# EAGLE design 2xVCA_SMD (EAGLE 7.1.0)
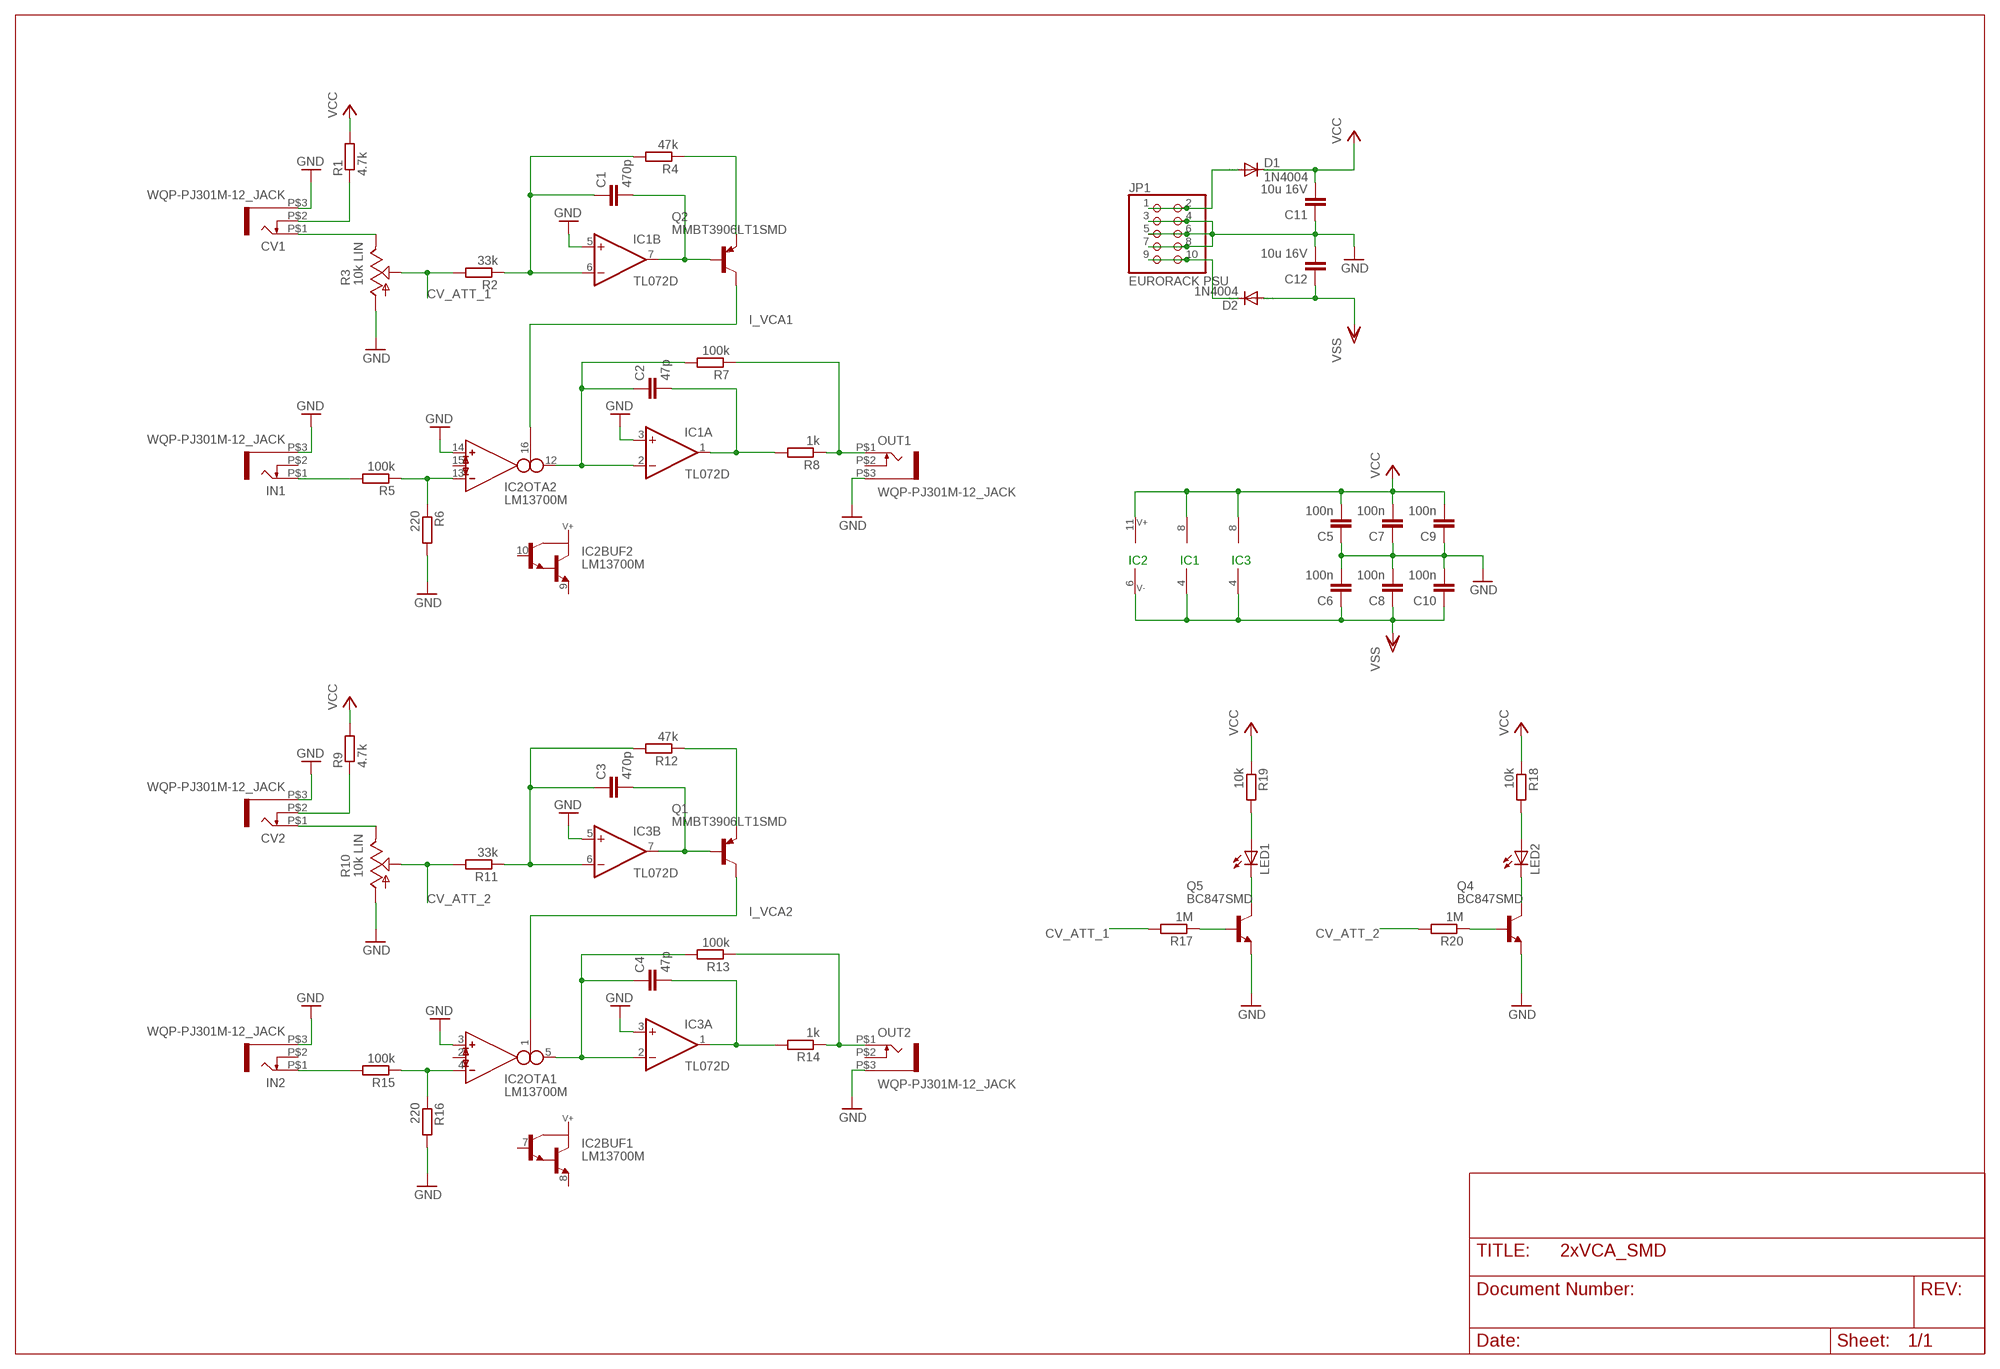
[diagram p0: schematic, sheet 1]

## Parts
C1  470p  C-EUC0603K  [C0603K]
C2  47p  C-EUC0603K  [C0603K]
C3  470p  C-EUC0603K  [C0603K]
C4  47p  C-EUC0603K  [C0603K]
C5  100n  C-EUC0603K  [C0603K]
C6  100n  C-EUC0603K  [C0603K]
C7  100n  C-EUC0603K  [C0603K]
C8  100n  C-EUC0603K  [C0603K]
C9  100n  C-EUC0603K  [C0603K]
C10  100n  C-EUC0603K  [C0603K]
C11  10u 16V  C-EUC1206K  [C1206K]
C12  10u 16V  C-EUC1206K  [C1206K]
CV1  WQP-PJ301M-12_JACK  [WQP-PJ301M-12_JACK]
CV2  WQP-PJ301M-12_JACK  [WQP-PJ301M-12_JACK]
D1  1N4004  DIODE-DO214AA  [DO214AA]
D2  1N4004  DIODE-DO214AA  [DO214AA]
IC1  TL072D  [SO08]
IC2  LM13700M  [SO16]
IC3  TL072D  [SO08]
IN1  WQP-PJ301M-12_JACK  [WQP-PJ301M-12_JACK]
IN2  WQP-PJ301M-12_JACK  [WQP-PJ301M-12_JACK]
JP1  EURORACK PSU  PINHD-2X5  [2X05]
LED1  LED3MM  [LED3MM]
LED2  LED3MM  [LED3MM]
OUT1  WQP-PJ301M-12_JACK  [WQP-PJ301M-12_JACK]
OUT2  WQP-PJ301M-12_JACK  [WQP-PJ301M-12_JACK]
Q1  MMBT3906LT1SMD  [SOT23-BEC]
Q2  MMBT3906LT1SMD  [SOT23-BEC]
Q4  BC847SMD  [SOT23]
Q5  BC847SMD  [SOT23]
R1  4.7k  R-EU_R0603  [R0603]
R2  33k  R-EU_R0603  [R0603]
R3  10k LIN  POT_USVERTICAL  [ALPS_POT_VERTICAL]
R4  47k  R-EU_R0603  [R0603]
R5  100k  R-EU_R0603  [R0603]
R6  220  R-EU_R0603  [R0603]
R7  100k  R-EU_R0603  [R0603]
R8  1k  R-EU_R0603  [R0603]
R9  4.7k  R-EU_R0603  [R0603]
R10  10k LIN  POT_USVERTICAL  [ALPS_POT_VERTICAL]
R11  33k  R-EU_R0603  [R0603]
R12  47k  R-EU_R0603  [R0603]
R13  100k  R-EU_R0603  [R0603]
R14  1k  R-EU_R0603  [R0603]
R15  100k  R-EU_R0603  [R0603]
R16  220  R-EU_R0603  [R0603]
R17  1M  R-EU_R0603  [R0603]
R18  10k  R-EU_R0603  [R0603]
R19  10k  R-EU_R0603  [R0603]
R20  1M  R-EU_R0603  [R0603]

## Nets
CV_ATT_1: R2.2 R3.P$2(S) R17.2
CV_ATT_2: R10.P$2(S) R11.2 R20.2
GND: C5.1 C6.2 C7.1 C8.2 C9.1 C10.2 C11.1 C12.2 CV1.P$3 CV2.P$3 IC1.3(A:+IN) IC1.5(B:+IN) IC2.3(OTA1:IN_P) IC2.14(OTA2:IN_P) IC3.3(A:+IN) IC3.5(B:+IN) IN1.P$3 IN2.P$3 JP1.3 JP1.4 JP1.5 JP1.6 JP1.7 JP1.8 OUT1.P$3 OUT2.P$3 Q4.2(E) Q5.2(E) R3.P$3(A) R6.2 R10.P$3(A) R16.2
I_VCA1: IC2.16(OTA2:I_BIAS) Q2.C
I_VCA2: IC2.1(OTA1:I_BIAS) Q1.C
N$1: IN2.P$1 R15.2
N$2: CV1.P$2 R1.1
N$3: CV1.P$1 R3.P$1(E)
N$4: Q5.1(B) R17.1
N$5: C1.1 IC1.6(B:-IN) R2.1 R4.2
N$6: C2.1 IC1.2(A:-IN) IC2.12(OTA2:OUT) R7.2
N$7: C1.2 IC1.7(B:OUT) Q2.B
N$8: Q2.E R4.1
N$9: IC2.13(OTA2:IN_N) R5.1 R6.1
N$10: IC2.4(OTA1:IN_N) R15.1 R16.1
N$11: IN1.P$1 R5.2
N$12: C2.2 IC1.1(A:OUT) R8.2
N$13: OUT1.P$1 R7.1 R8.1
N$15: C4.1 IC2.5(OTA1:OUT) IC3.2(A:-IN) R13.2
N$16: CV2.P$2 R9.1
N$17: CV2.P$1 R10.P$1(E)
N$18: LED1.A R19.2
N$19: C3.1 IC3.6(B:-IN) R11.1 R12.2
N$20: OUT2.P$1 R13.1 R14.1
N$21: C3.2 IC3.7(B:OUT) Q1.B
N$22: Q1.E R12.1
N$23: C4.2 IC3.1(A:OUT) R14.2
N$24: LED1.K(C) Q5.3(C)
N$25: LED2.A R18.2
N$26: LED2.K(C) Q4.3(C)
N$27: Q4.1(B) R20.1
N$28: D1.A JP1.1 JP1.2
N$30: D2.C JP1.9 JP1.10
VCC: C5.2 C7.2 C9.2 C11.2 D1.C IC1.8(P:V+) IC2.11(SUPPLY:V+) IC3.8(P:V+) R1.2 R9.2 R18.1 R19.1
VSS: C6.1 C8.1 C10.1 C12.1 D2.A IC1.4(P:V-) IC2.6(SUPPLY:V-) IC3.4(P:V-)
Unconnected: IC2.2(OTA1:I_DIODE) IC2.7(BUF1:B) IC2.8(BUF1:E) IC2.9(BUF2:E) IC2.10(BUF2:B) IC2.15(OTA2:I_DIODE) IN1.P$2 IN2.P$2 OUT1.P$2 OUT2.P$2

## Notes on the sheet
- IC2 | IC1 | IC3

## Library data of the parts
C1-C12 = rcl:C-EU: CAPACITOR, European symbol
CV1 CV2 IN1 IN2 OUT1 OUT2 = thonkiconn:WQP-PJ301M-12_JACK
D1 D2 = diode:DIODE-: DIODE
IC1 IC3 = linear:TL072: OP AMP
IC2 = ota:LM13700: Dual OTA with buffers
JP1 = pinhead:PINHD-2X5: PIN HEADER
LED1 LED2 = led:LED: LED OSRAM: - CHIPLED LG R971, LG N971, LY N971, LG Q971, LY Q971, LO R971, LY R971 LH N974, LH R974 LS Q976, LO Q976, LY Q976 LO Q996 - Hyper CHIPLED LW Q18S LB Q993, LB Q99A, LB R99A - SideLED LS A670, LO A670, LY A670, LG A670, LP A670 LB A673, LV A673, LT A673, LW A673 LH A674 LY A675 LS A676, LA A676, LO A676, LY A676, LW A676 LS A679, LY A679, LG A679 - Hyper Micro SIDELED® LS Y876, LA Y876, LO Y876, LY Y876 LT Y87S - SmartLED LW L88C, LW L88S LB L89C, LB L89S, LG L890 LS L89K, LO L89K, LY L89K LS L896, LA L896, LO L896, LY L896 - TOPLED LS T670, LO T670, LY T670, LG T670, LP T670 LSG T670, LSP T670, LSY T670, LOP T670, LYG T670 LG T671, LOG T671, LSG T671 LB T673, LV T673, LT T673, LW T673 LH T674 LS T676, LA T676, LO T676, LY T676, LB T676, LH T676, LSB T676, LW T676 LB T67C, LV T67C, LT T67C, LS T67K, LO T67K, LY T67K, LW E67C LS E67B, LA E67B, LO E67B, LY E67B, LB E67C, LV E67C, LT E67C LW T67C LS T679, LY T679, LG T679 LS T770, LO T770, LY T770, LG T770, LP T770 LB T773, LV T773, LT T773, LW T773 LH T774 LS E675, LA E675, LY E675, LS T675 LS T776, LA T776, LO T776, LY T776, LB T776 LHGB T686 LT T68C, LB T68C - Hyper Mini TOPLED® LB M676 - Mini TOPLED Santana® LG M470 LS M47K, LO M47K, LY M47K Source: http://www.osram.convergy.de LUXEON: - LUMILED® LXK2-PW12-R00, LXK2-PW12-S00, LXK2-PW14-U00, LXK2-PW14-V00 LXK2-PM12-R00, LXK2-PM12-S00, LXK2-PM14-U00 LXK2-PE12-Q00, LXK2-PE12-R00, LXK2-PE12-S00, LXK2-PE14-T00, LXK2-PE14-U00 LXK2-PB12-K00, LXK2-PB12-L00, LXK2-PB12-M00, LXK2-PB14-N00, LXK2-PB14-P00, LXK2-PB14-Q00 LXK2-PR12-L00, LXK2-PR12-M00, LXK2-PR14-Q00, LXK2-PR14-R00 LXK2-PD12-Q00, LXK2-PD12-R00, LXK2-PD12-S00 LXK2-PH12-R00, LXK2-PH12-S00 LXK2-PL12-P00, LXK2-PL12-Q00, LXK2-PL12-R00 Source: www.luxeon.com KINGBRIGHT: KA-3528ASYC Source: www.kingbright.com
Q1 Q2 = transistor-pnp:MMBT3906*: PNP Transistror
Q4 Q5 = transistor-npn:BC847*: NPN Transistor
R1 R2 R4-R9 R11-R20 = rcl:R-EU_: RESISTOR, European symbol
R3 R10 = pot-alps:POT_US

## Board
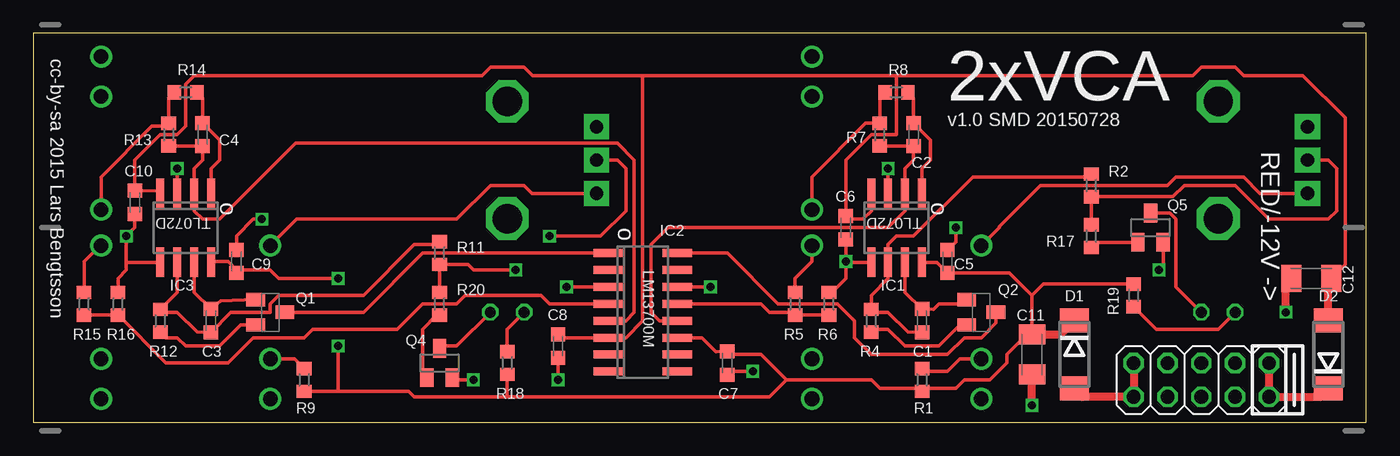
[diagram p1: board, top side]
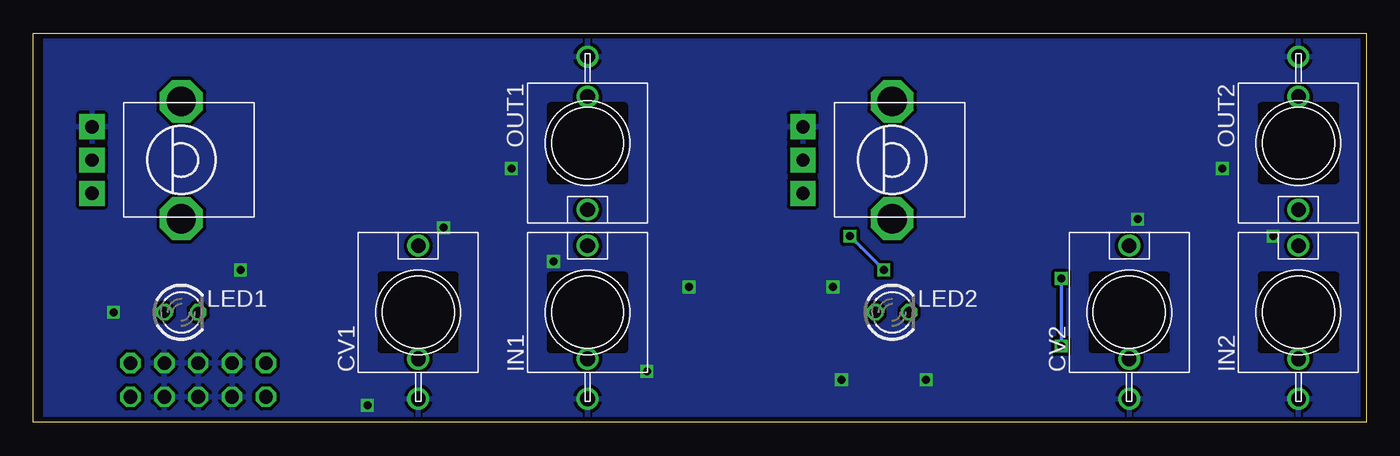
[diagram p2: board, bottom side, seen from below]

Size 100 x 29.2 mm. Coordinates in mm from the lower left corner, seen from the top.
Outline: 0,0 100,0 100,29.2 0,29.2 0,0
Copper layers (1*16): Top 0.0356mm / dielectric 1.5011mm / Bottom 0.0356mm
Design rules "LaenPCBOrder": minimum track width 6mil, minimum drill 13mil, track to track 6mil, track to pad 6mil, pad to pad 6mil, via to via 6mil, smd to smd 6mil, copper to edge 15mil, drill to drill 6mil, minimum pad ring 7mil, minimum via ring 7mil, stop-mask expansion 3mil, vias tented up to drill 0mil, thermal gap 10mil

### Footprints (pad centres in the part's own frame; a part is rotated, then mirrored left to right if it is on the bottom)
C0603K = smd 1.05 x 1.08: 1 -0.875,0; 2 0.875,0
C1206K = smd 1.5 x 2: 1 -1.5,0; 2 1.5,0
WQP-PJ301M-12_JACK = drill 1.1: P$1 0,5; P$2 0,-3.5; P$3 0,-6.5
DO214AA = smd 1.8 x 2.2: A 2.55,0; C -2.55,0
SO08 = smd 0.6 x 2.2: 1 -1.905,-2.6; 2 -0.635,-2.6; 3 0.635,-2.6; 4 1.905,-2.6; 5 1.905,2.6; 6 0.635,2.6; 7 -0.635,2.6; 8 -1.905,2.6
SO16 = smd 0.6 x 2.2: 1 -4.445,-2.6; 2 -3.175,-2.6; 3 -1.905,-2.6; 4 -0.635,-2.6; 5 0.635,-2.6; 6 1.905,-2.6; 7 3.175,-2.6; 8 4.445,-2.6; 9 4.445,2.6; 10 3.175,2.6; 11 1.905,2.6; 12 0.635,2.6; 13 -0.635,2.6; 14 -1.905,2.6; 15 -3.175,2.6; 16 -4.445,2.6
2X05 = drill 1.016 octagon: 1 -5.08,-1.27; 2 -5.08,1.27; 3 -2.54,-1.27; 4 -2.54,1.27; 5 0,-1.27; 6 0,1.27; 7 2.54,-1.27; 8 2.54,1.27; 9 5.08,-1.27; 10 5.08,1.27
LED3MM = drill 0.813 octagon: A -1.27,0; K 1.27,0
SOT23-BEC = smd 1 x 1.4: B -0.95,-1.1; C 0,1.1; E 0.95,-1.1
SOT23 = smd 1 x 1.4: 1 -0.95,-1.1; 2 0.95,-1.1; 3 0,1.1
R0603 = smd 1 x 1.1: 1 -0.85,0; 2 0.85,0
ALPS_POT_VERTICAL = drill 1 pad 1.88 square: P$1 -2.5,6.7; P$2 0,6.7; P$3 2.5,6.7 | drill 2.2 pad 3.175 octagon: P$4 -4.4,0; P$5 4.4,0

### Placement (x,y rotation side)
C1  66.67,7.62 90 top
C2  66.04,21.59 90 top
C3  13.34,7.62 90 top
C4  12.7,21.59 90 top
C5  68.58,12.07 270 top
C6  60.96,14.61 270 top
C7  52.07,4.45 90 top
C8  39.37,5.71 270 top
C9  15.24,12.07 270 top
C10  7.62,16.51 270 top
C11  74.93,5.08 90 top
C12  95.89,10.8 180 top
CV1  71.12,8.26 0 bottom
CV2  17.78,8.26 0 bottom
D1  78.11,5.08 270 top
D2  97.16,5.08 90 top
IC1  64.77,14.61 180 top
IC2  45.72,8.26 270 top
IC3  11.43,14.61 180 top
IN1  58.42,8.26 0 bottom
IN2  5.08,8.26 0 bottom
JP1  87.63,3.18 0 top
LED1  88.9,8.26 0 bottom
LED2  35.56,8.26 0 bottom
OUT1  58.42,20.96 180 bottom
OUT2  5.08,20.96 180 bottom
Q1  17.78,8.26 270 top
Q2  71.12,8.26 270 top
Q4  30.48,4.45 0 top
Q5  83.82,14.61 0 top
R1  66.67,3.18 270 top
R2  79.38,17.78 270 top
R3  88.9,19.68 90 bottom
R4  62.87,7.62 90 top
R5  57.15,8.89 90 top
R6  59.69,8.89 90 top
R7  63.5,21.59 270 top
R8  64.77,24.77 0 top
R9  20.32,3.18 270 top
R10  35.56,19.68 90 bottom
R11  30.48,12.7 270 top
R12  9.53,7.62 90 top
R13  10.16,21.59 270 top
R14  11.43,24.77 0 top
R15  3.81,8.89 90 top
R16  6.35,8.89 90 top
R17  79.38,13.97 90 top
R18  35.56,4.45 90 top
R19  82.55,9.53 270 top
R20  30.48,8.89 90 top

### Tracks (layer width: path | path; a pad name or v marks a point on that pad's centre or on a via)
CV_ATT_1
  Top 0.254: R17.2 R2.2 85.51,16.93 86.36,17.78 90.17,17.78 92.71,15.24 97.16,15.24 97.79,15.88 97.79,19.05 97.16,19.68 R3.P$2
CV_ATT_2  (via drill 0.6)
  Top 0.254: R20.2 R11.2 32.6,11.85 33.02,11.43 v36.2,11.43 | v38.73,13.97 42.55,13.97 44.45,15.88 44.45,19.05 43.81,19.68 R10.P$2
  Bottom 0.254: v36.2,11.43 v38.73,13.97
GND  (via drill 0.6)
  Top 0.254: C10.2 7.62,14.61 v6.99,13.97 6.99,12.07 7.04,12 | IC3.5 7.04,12 | R16.2 6.35,10.8 6.99,11.43 6.99,11.95 7.04,12 | C9.1 15.24,13.97 16.51,15.24 v17.14,15.24 | v50.8,10.16 IC2.14 | C6.2 v60.96,12.07 | IC1.5 61.02,12 v60.96,12.07 | R6.2 59.91,9.74 60.96,10.8 v60.96,12.07 | v69.22,14.61 69.22,13.55 C5.1 | v39.37,3.18 C8.2 | IC2.3 v40.01,10.16 | v53.98,3.81 52.28,3.81 C7.1 | IC1.3 v64.14,19.05 | v10.79,19.05 IC3.3 | Q5.2 84.77,11.75 v84.45,11.43 | v33.02,3.18 31.6,3.18 Q4.2
  Top 0.61: v74.93,1.27 C11.1 | v93.98,8.26 93.98,10.39 C12.2
  pour Bottom (isolate 0.254): 0.64,29.21 99.06,29.21 99.06,0 0.64,0
I_VCA1
  Top 0.254: Q2.C 72.22,7.45 71.12,6.35 69.85,6.35 68.58,5.08 62.87,5.08 61.59,6.35 61.59,7.62 60.33,8.89 55.88,8.89 52.07,12.7 IC2.16
I_VCA2
  Top 0.254: IC2.1 29.21,12.7 24.77,8.26 Q1.C
N$1
  Top 0.254: IN2.P$1 5,13.25 3.81,12.07 R15.2
N$2
  Top 0.254: CV1.P$2 69.53,4.76 68.58,3.81 66.89,3.81 R1.1
N$3
  Top 0.254: R3.P$1 92.03,17.18 90.81,18.41 85.72,18.41 85.09,17.78 75.56,17.78 72.47,14.68 72.47,14.61 CV1.P$1
N$4
  Top 0.254: Q5.1 79.76,13.5 R17.1
N$5
  Top 0.254: C1.1 65.62,6.77 64.14,8.26 63.08,8.26 R4.2 62.87,9.53 64.14,10.8 IC1.6 64.14,13.34 64.77,13.97 66.04,13.97 70.48,18.41 79.16,18.41 R2.1
N$6
  Top 0.254: R7.2 63.52,20.71 C2.1 66.04,19.68 65.41,19.05 IC1.2 65.41,15.88 64.14,14.61 47.62,14.61 46.35,13.34 46.35,8.26 46.99,7.62 IC2.12
N$7
  Top 0.254: IC1.7 65.41,9.74 C1.2 67.53,8.47 67.94,8.89 69.7,8.89 Q2.B
N$8
  Top 0.254: Q2.E 69.53,7.3 67.94,5.71 65.41,5.71 64.14,6.98 63.08,6.98 R4.1
N$9
  Top 0.254: IC2.13 54.61,8.89 55.24,8.26 56.94,8.26 R5.1 R6.1
N$10
  Top 0.254: R15.1 R16.1 9.95,4.45 14.61,4.45 16.51,6.35 20.32,6.35 20.95,6.98 27.3,6.98 29.21,8.89 31.75,8.89 32.38,9.53 38.1,9.53 38.73,8.89 IC2.4
N$11
  Top 0.254: IN1.P$1 58.42,12.07 57.15,10.8 R5.2
N$12
  Top 0.254: R8.2 66.04,24.34 C2.2 67.31,21.2 67.31,19.68 66.67,19.05 IC1.1
N$13
  Top 0.254: R8.1 63.5,24.34 R7.1 62.45,22.44 58.42,18.41 OUT1.P$1
N$15
  Top 0.254: R13.2 10.19,20.71 C4.1 12.7,19.68 12.06,19.05 IC3.2 12.06,15.88 12.7,15.24 13.97,15.24 19.68,20.96 43.81,20.96 45.09,19.68 45.09,8.26 44.45,7.62 IC2.5
N$16
  Top 0.254: CV2.P$2 19.59,4.76 R9.1
N$17
  Top 0.254: R10.P$1 37.42,17.18 36.83,17.78 34.29,17.78 31.75,15.24 19.77,15.24 CV2.P$1
N$18
  Top 0.254: LED1.A 88.9,6.98 84.24,6.98 R19.2
N$19
  Top 0.254: IC3.6 10.79,9.74 R12.2 9.74,8.26 10.79,8.26 12.28,6.77 C3.1 14.82,8.26 17.78,8.26 17.78,8.89 18.41,9.53 24.77,9.53 28.57,13.34 30.27,13.34 R11.1
N$20
  Top 0.254: R14.1 10.16,24.34 R13.1 9.95,22.23 8.89,22.23 5.08,18.41 OUT2.P$1
N$21
  Top 0.254: IC3.7 12.06,9.74 C3.2 14.04,9.11 Q1.B
N$22
  Top 0.254: Q1.E 15.56,7.3 13.97,5.71 11.43,5.71 10.79,6.35 9.95,6.35 R12.1
N$23
  Top 0.254: IC3.1 13.34,19.05 13.97,19.68 13.97,21.2 C4.2 12.7,24.34 R14.2
N$24
  Top 0.254: Q5.3 85.26,15.71 85.72,15.24 85.72,10.16 LED1.K
N$25
  Top 0.254: LED2.A 35.56,6.98 R18.2
N$26
  Top 0.254: LED2.K 31.75,5.71 30.65,5.71 Q4.3
N$27
  Top 0.254: R20.1 30.27,8.04 29.21,6.98 29.21,3.67 Q4.1
N$28
  Top 0.61: JP1.2 JP1.1 78.73,1.91 D1.A
N$30
  Top 0.61: JP1.10 JP1.9 96.53,1.91 D2.C
VCC  (via drill 0.6)
  Top 0.254: C9.2 15.24,11.43 | 15.24,11.43 14.61,12.07 13.39,12.07 IC3.8 | v22.86,10.8 18.41,10.8 17.78,11.43 15.24,11.43 | IC1.8 67.79,12 C5.2 73.24,11.21 74.93,9.53 | 74.93,9.53 C11.2 74.53,6.58 73.03,5.08 73.03,4.45 71.75,3.18 69.85,3.18 69.22,2.54 66.89,2.54 R1.2 66.46,2.54 63.5,2.54 62.87,3.18 56.52,3.18 | IC2.11 50.16,6.35 51.22,5.29 C7.2 52.07,5.08 54.61,5.08 56.52,3.18 | R9.2 22.86,2.32 | 22.86,2.32 v22.86,5.71 | 22.86,2.32 28.16,2.32 28.57,1.91 35.56,1.91 | 35.56,1.91 55.24,1.91 56.52,3.18 | R18.1 35.56,1.91 | R19.1 75.78,10.38 74.93,9.53
  Top 0.61: C11.2 77.06,6.58 D1.C
  Bottom 0.254: v22.86,5.71 v22.86,10.8
VSS
  Top 0.254: IC3.4 9.37,17.36 C10.1 7.62,19.68 9.53,21.59 10.79,21.59 11.43,22.23 11.43,25.4 12.06,26.04 33.66,26.04 34.29,26.67 36.83,26.67 37.47,26.04 45.72,26.04 | 64.77,26.04 87,26.04 87.63,26.67 90.17,26.67 90.81,26.04 95.25,26.04 98.42,22.86 98.42,11.84 C12.1 | 64.77,26.04 45.72,26.04 | IC1.4 62.87,15.88 62.23,15.24 61.17,15.24 C6.1 60.96,19.68 62.87,21.59 64.77,21.59 64.77,26.04 | 45.72,26.04 45.72,7.62 44.45,6.35 IC2.6 39.59,6.35 C8.1
  Top 0.61: D2.A 97.16,10.57 C12.1

### Text on the board
tNames: cc-by-sa 2015 Lars Bengtsson | 2xVCA | v1.0 SMD 20150728 | RED/-12V -> | o | o | o